# Altium schematic sheet 13 - USB.SchDoc
size B; CompanyName: Microchip Technology Inc.; Organization: Microchip Technology; Address1: 2355 West Chandler Blvd.; Address2: Chandler, AZ  85224; Address4: USA; DocumentNumber: 13; SheetNumber: 13; SheetTotal: 15; SheetTitle: USBB, USBC; Time: Time
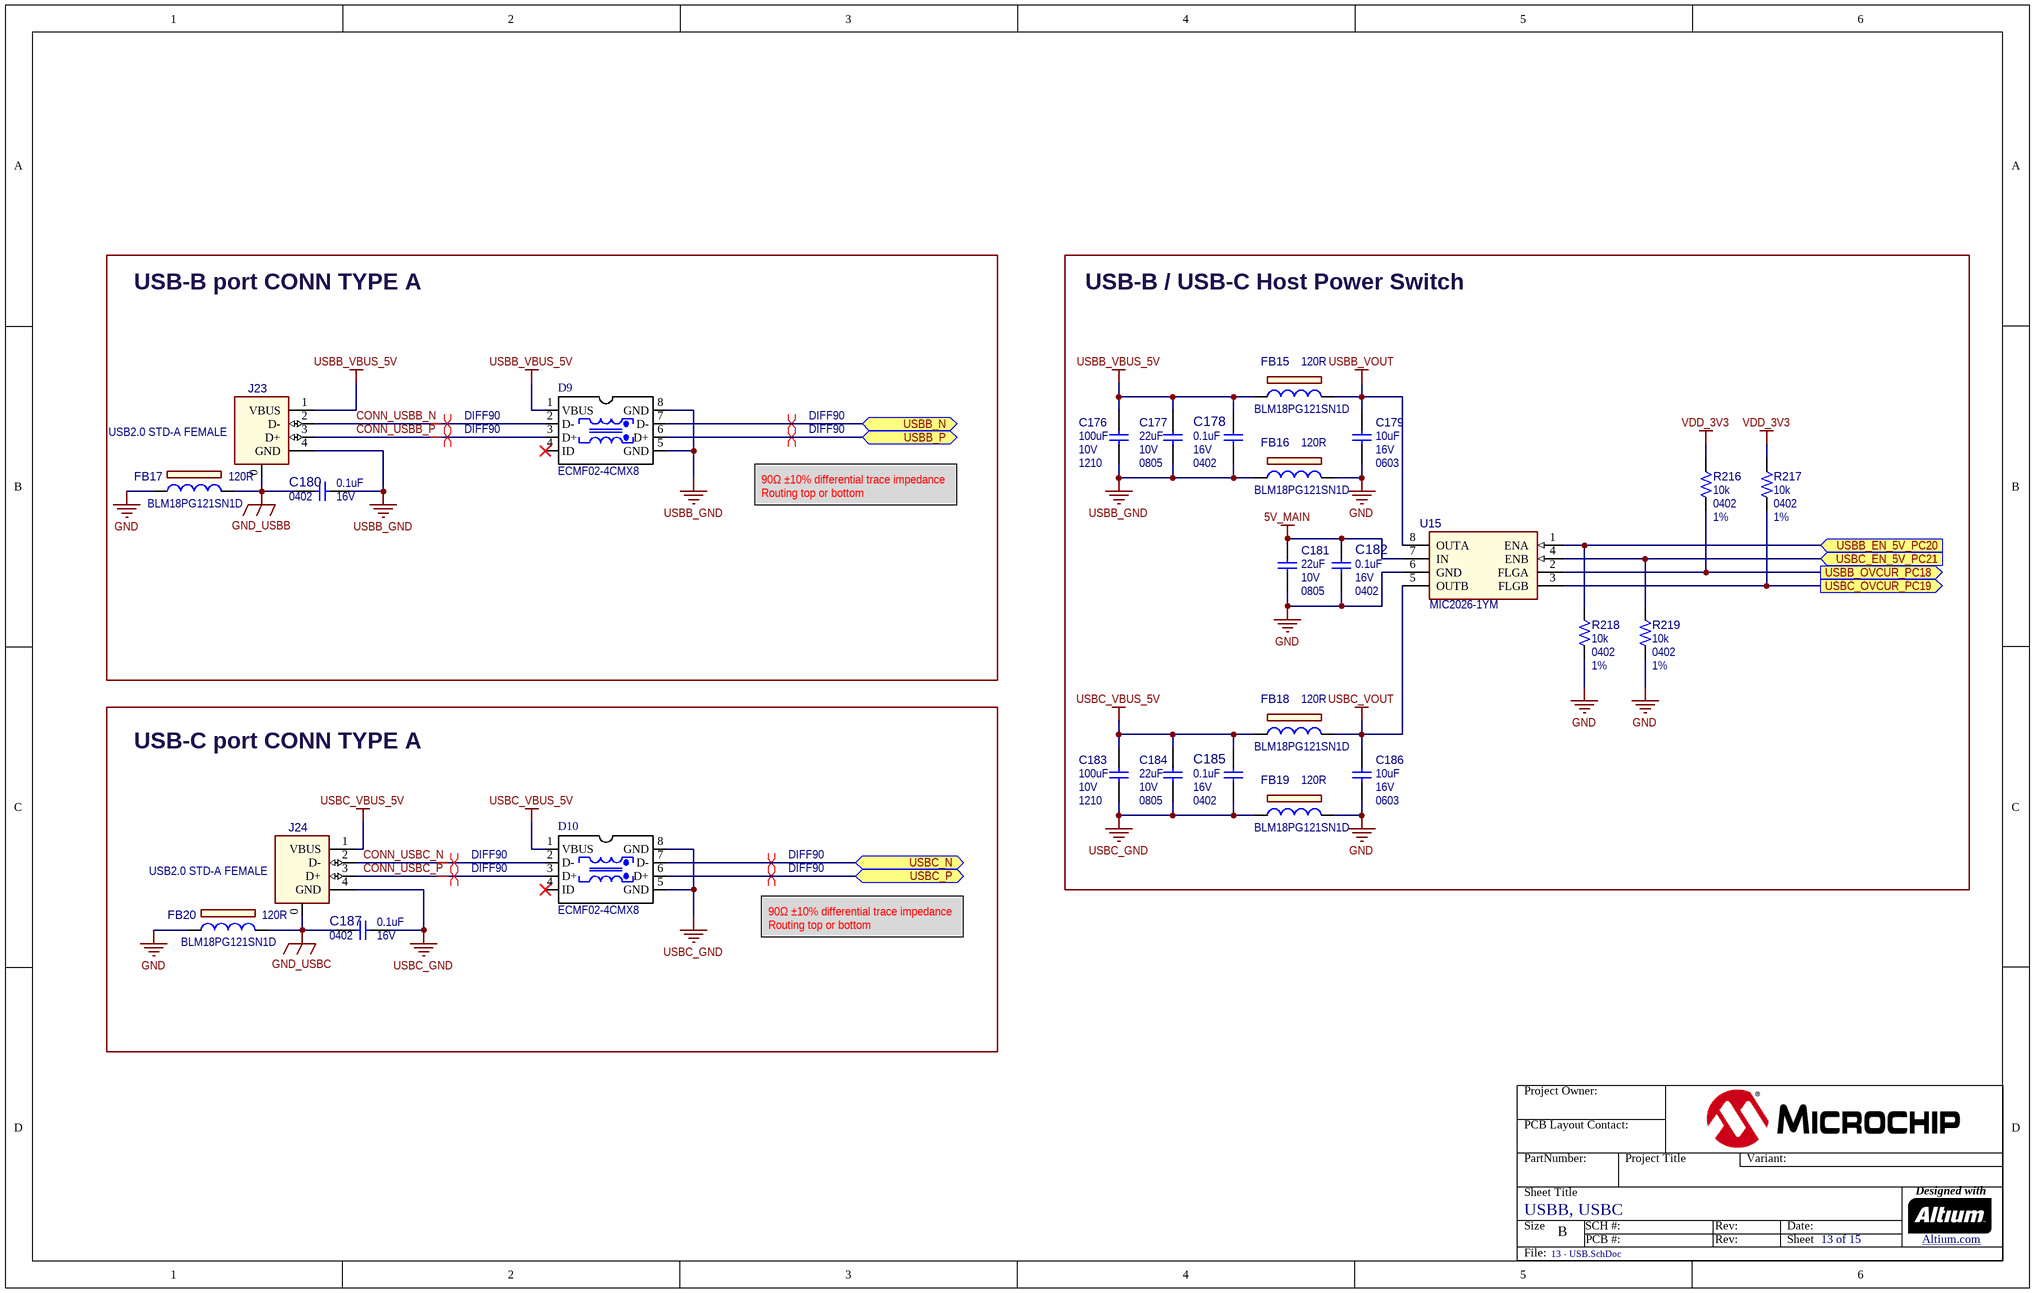
[diagram p0: 13 - USB.SchDoc]

## Parts
C176  value 100uF  Voltage: 10V  Package: 1210  [CAP_C_1210]  (hidden comment: Capacitor NP)
C177  value 22uF  Voltage: 10V  Package: 0805  [CAP_C_0805]  (hidden comment: Capacitor NP)
C178  value 0.1uF  Voltage: 16V  Package: 0402  [CAP_C_0402]  (hidden comment: Capacitor NP)
C179  value 10uF  Voltage: 16V  Package: 0603  [CAP_C_0603]  (hidden comment: Capacitor NP)
C180  value 0.1uF  Voltage: 16V  Package: 0402  [CAP_C_0402]  (hidden comment: Capacitor NP)
C181  value 22uF  Voltage: 10V  Package: 0805  [CAP_C_0805]  (hidden comment: Capacitor NP)
C182  value 0.1uF  Voltage: 16V  Package: 0402  [CAP_C_0402]  (hidden comment: Capacitor NP)
C183  value 100uF  Voltage: 10V  Package: 1210  [CAP_C_1210]  (hidden comment: Capacitor NP)
C184  value 22uF  Voltage: 10V  Package: 0805  [CAP_C_0805]  (hidden comment: Capacitor NP)
C185  value 0.1uF  Voltage: 16V  Package: 0402  [CAP_C_0402]  (hidden comment: Capacitor NP)
C186  value 10uF  Voltage: 16V  Package: 0603  [CAP_C_0603]  (hidden comment: Capacitor NP)
C187  value 0.1uF  Voltage: 16V  Package: 0402  [CAP_C_0402]  (hidden comment: Capacitor NP)
D9  value ECMF02-4CMX8  [DIODE ESD ECMF02-4CMX8]  (hidden comment: ESD_ECMF02-4CMX8)
D10  value ECMF02-4CMX8  [DIODE ESD ECMF02-4CMX8]  (hidden comment: ESD_ECMF02-4CMX8)
FB15  value 120R  Manufacturer Part Number 1: BLM18PG121SN1D  [IND_C_0603]  (hidden comment: Ferrite Bead)
FB16  value 120R  Manufacturer Part Number 1: BLM18PG121SN1D  [IND_C_0603]  (hidden comment: Ferrite Bead)
FB17  value 120R  Manufacturer Part Number 1: BLM18PG121SN1D  [IND_C_0603]  (hidden comment: Ferrite Bead)
FB18  value 120R  Manufacturer Part Number 1: BLM18PG121SN1D  [IND_C_0603]  (hidden comment: Ferrite Bead)
FB19  value 120R  Manufacturer Part Number 1: BLM18PG121SN1D  [IND_C_0603]  (hidden comment: Ferrite Bead)
FB20  value 120R  Manufacturer Part Number 1: BLM18PG121SN1D  [IND_C_0603]  (hidden comment: Ferrite Bead)
J23  value USB2.0 STD-A FEMALE  [CON_USB2.0-A_TH_RA_FCI_87520-0010BLF]  (hidden comment: CON USB2.0 A-B)
J24  value USB2.0 STD-A FEMALE  [CON_USB2.0-A_TH_RA_FCI_87520-0010BLF]  (hidden comment: CON USB2.0 A-B)
R216  value 10k  Package: 0402  Tolerance: 1%  [RES_C_0402]  (hidden comment: Resistor)
R217  value 10k  Package: 0402  Tolerance: 1%  [RES_C_0402]  (hidden comment: Resistor)
R218  value 10k  Package: 0402  Tolerance: 1%  [RES_C_0402]  (hidden comment: Resistor)
R219  value 10k  Package: 0402  Tolerance: 1%  [RES_C_0402]  (hidden comment: Resistor)
U15  value MIC2026-1YM  [SOIC-8]  (hidden comment: MIC2026-2076 DIP-8 SOIC-8)

## Blocks framed on the sheet
USB-B port CONN TYPE A: C180 D9 FB17 J23
USB-B / USB-C Host Power Switch: C176-C179 C181-C186 FB15 FB16 FB18 FB19 R216-R219 U15
USB-C port CONN TYPE A: C187 D10 FB20 J24

## Ports
USBB_EN_5V_PC20 (in), USBB_N (bidir), USBB_OVCUR_PC18 (out), USBB_P (bidir), USBC_EN_5V_PC21 (in), USBC_N (bidir), USBC_OVCUR_PC19 (out), USBC_P (bidir)

## Nets
5V_MAIN: C181.1 C182.1 U15.7(IN)
GND: C179.2 C181.2 C182.2 C186.2 FB16.2 FB17.1 FB19.2 FB20.1 R218.1 R219.1 U15.6(GND)
GND_USBB: C180.1 FB17.2 J23.0(SHLD)
GND_USBC: C187.1 FB20.2 J24.0(SHLD)
USBB_GND: C176.2 C177.2 C178.2 C180.2 D9.5(GND) D9.8(GND) FB16.1 J23.4(GND)
USBB_VBUS_5V: C176.1 C177.1 C178.1 D9.1(VBUS) FB15.1 J23.1(VBUS)
USBB_VOUT: C179.1 FB15.2 U15.8(OUTA)
USBC_GND: C183.2 C184.2 C185.2 C187.2 D10.5(GND) D10.8(GND) FB19.1 J24.4(GND)
USBC_VBUS_5V: C183.1 C184.1 C185.1 D10.1(VBUS) FB18.1 J24.1(VBUS)
USBC_VOUT: C186.1 FB18.2 U15.5(OUTB)
VDD_3V3: R216.2 R217.2
CONN_USBB_N: D9.2(D-) J23.2(D-)
CONN_USBB_P: D9.3(D+) J23.3(D+)
CONN_USBC_N: D10.2(D-) J24.2(D-)
CONN_USBC_P: D10.3(D+) J24.3(D+)
USBB_EN_5V_PC20: R218.2 U15.1(ENA) ; port USBB_EN_5V_PC20
USBB_N: D9.7(D-) ; port USBB_N
USBB_OVCUR_PC18: R216.1 U15.2(FLGA) ; port USBB_OVCUR_PC18
USBB_P: D9.6(D+) ; port USBB_P
USBC_EN_5V_PC21: R219.2 U15.4(ENB) ; port USBC_EN_5V_PC21
USBC_N: D10.7(D-) ; port USBC_N
USBC_OVCUR_PC19: R217.1 U15.3(FLGB) ; port USBC_OVCUR_PC19
USBC_P: D10.6(D+) ; port USBC_P

Not connected (* = marked no-connect by the designer): D9 4(ID)*; D10 4(ID)*

## Layout directives
differential pair; differential pair class DIFF90; net class DIFF90; rule Matched Net Lengths [Tolerance = 4mil]: CONN_USBB_N, CONN_USBB_P, CONN_USBC_N, CONN_USBC_P, USBB_N, USBB_P, USBC_N, USBC_P

## Notes on the sheet
- 90Ω ±10% differential trace impedance
  Routing top or bottom
- Project Owner:
- PCB Layout Contact:
- PartNumber:
- Project Title
- Variant:
- Sheet Title
- Size
- B
- SCH #:
- PCB #:
- Rev:
- Date:
- Sheet
- Designed with
- Altium.com <http://go.altium.com/MicrochipLandingPage_Evaluation.html>
- File:

## Library data of the parts
C176 C183 = CAP0598: Capacitor; Manufacturer 1: Murata Electronics North America; Manufacturer Part Number 1: GRM32ER61A107ME20L; Description_: CAP CER 100uF 10V 20% X5R SMD 1210; Dev Tools Status: Production; Tolerance: 20%; Temperature Coeffcient: X5R; Type: Ceramic; Populated: Yes; MCHP-ID: CAP0598; Revision: 1; Symbol: Capacitor NP; Status: MCL Design; ComponentLink1URL: https://chn-vm-apps.microchip.com/mchprepo/parts/Datasheets/mlcc01_e.pdf; ComponentLink1Description: SVN Datasheet; ComponentLink2URL: C:\ALTIUM_WORK\00001_MCHP-CDB\Datasheets\mlcc01_e.pdf; ComponentLink2Description: Local Datasheet; ComponentLink3URL: C:\ALTIUM_WORK\00001_MCHP-CDB\Library\LibraryRefs\Capacitor NP.SchLib; ComponentLink3Description: Open Symbol; ComponentLink4URL: C:\ALTIUM_WORK\00001_MCHP-CDB\Library\Footprints\CAP_C_1210.PcbLib; ComponentLink4Description: Open Footprint; ComponentLink5Description: Open Footprint 2; ComponentLink6Description: Open Footprint 3; ComponentLink7Description: Open Footprint 4; Operating Temperature: -55C to +85C; Category: Capacitor; Manufacturer 2: Taiyo Yuden; Manufacturer Part Number 2: LMK325BJ107MM-T; Supplier 1: Digi-Key; Supplier Part Number 1: 490-9969-1-ND; Supplier 2: Digi-Key; Supplier Part Number 2: 587-1965-1-ND; Quantity Override: 1
C177 C181 C184 = CAP1618: Manufacturer 1: TDK Corporation; Manufacturer Part Number 1: C2012X7S1A226M125AC; Description_: CAP CER 22uF 10V 20% X7S SMD 0805; Dev Tools Status: Production; Tolerance: 20%; Temperature Coefficient: X7S; Type: Ceramic; Populated: YES; Owner: Razvan Cristescu; Restricted Sourcing: No; MCHP-ID: CAP1618; Revision: 3; Symbol: Capacitor NP; Status: MCL Design; ComponentLink1URL: https://chn-vm-apps.microchip.com/mchprepo/parts/Datasheets/mlcc_commercial_general_en.pdf; ComponentLink1Description: SVN Datasheet; ComponentLink2URL: C:\ALTIUM_WORK\00001_MCHP-CDB\Datasheets\mlcc_commercial_general_en.pdf; ComponentLink2Description: Local Datasheet; ComponentLink3URL: C:\ALTIUM_WORK\00001_MCHP-CDB\Library\LibraryRefs\Capacitor NP.SchLib; ComponentLink3Description: Open Symbol; ComponentLink4URL: C:\ALTIUM_WORK\00001_MCHP-CDB\Library\Footprints\CAP_C_0805.PcbLib; ComponentLink4Description: Open Footprint; ComponentLink5Description: Open Footprint 2; ComponentLink6Description: Open Footprint 3; ComponentLink7Description: Open Footprint 4; Operating Temperature: -55C to +125C; Category: Capacitor; Supplier 1: Digi-Key; Supplier Part Number 1: 445-14560-1-ND; Quantity Override: 1
C178 C182 C185 = CAP1033: Manufacturer 1: Hottech; Manufacturer Part Number 1: C1005B104K160NT; Description_: CAP CER 0.1uF 16V 10% X7R SMD 0402; Dev Tools Status: Production; Tolerance: 10%; Type: Ceramic; Owner: Sompoch Loboonlert; Populated: Yes; Temperature Coefficient: X7R; Restricted Sourcing: No; MCHP-ID: CAP1033; Revision: 10; Symbol: Capacitor NP; Status: MCL Design; ComponentLink1URL: https://chn-vm-apps.microchip.com/mchprepo/parts/Datasheets/L0005E.pdf; ComponentLink1Description: SVN Datasheet; ComponentLink2URL: C:\ALTIUM_WORK\00001_MCHP-CDB\Datasheets\L0005E.pdf; ComponentLink2Description: Local Datasheet; ComponentLink3URL: C:\ALTIUM_WORK\00001_MCHP-CDB\Library\LibraryRefs\Capacitor NP.SchLib; ComponentLink3Description: Open Symbol; ComponentLink4URL: C:\ALTIUM_WORK\00001_MCHP-CDB\Library\Footprints\CAP_C_0402.PcbLib; ComponentLink4Description: Open Footprint; ComponentLink5Description: Open Footprint 2; ComponentLink6Description: Open Footprint 3; ComponentLink7Description: Open Footprint 4; Operating Temperature: -55C to +125C; Category: Capacitor; Supplier 1: Hottech; Supplier Part Number 1: C1005B104K160NT; Quantity Override: 1; Manufacturer 2: KEMET; Manufacturer Part Number 2: C0402C104K4RAC7867; Manufacturer 3: Samsung Electro-Mechanics; Manufacturer Part Number 3: CL05B104KO5NNNC; Supplier 2: Digi-Key; Supplier Part Number 2: 399-C0402C104K4RAC7867TR-ND; Supplier 3: Digi-Key; Supplier Part Number 3: 1276-1001-1-ND; Manufacturer 4: Würth Elektronik; Manufacturer Part Number 4: 885012205037; Manufacturer 5: Samsung Electro-Mechanics; Manufacturer Part Number 5: CL05B104KO5NNND; Manufacturer 6: Samsung Electro-Mechanics; Manufacturer Part Number 6: CL05B104KO5NNNO; Manufacturer 7: Yageo; Manufacturer Part Number 7: CC0402KRX7R7BB104; Supplier 4: Digi-Key; Supplier Part Number 4: 732-7532-1-ND; Supplier 5: Mouser; Supplier Part Number 5: 187-CL05B104KO5NNND; Supplier 6: Samsung Electro-Mechanics; Supplier Part Number 6: CL05B104KO5NNNO; Supplier 7: Yageo; Supplier Part Number 7: CC0402KRX7R7BB104
C179 C186 = CAP2397: Manufacturer 1: Murata; Manufacturer Part Number 1: GRT188R61C106KE13D; Description_: CAP CER 10uF 16V 10% X5R SMD 0603 AEC-Q200; Dev Tools Status: Design; Tolerance: 10%; Temperature Coefficient: X5R; Type: Ceramic; Populated: YES; Owner: Sam Charles; MCHP-ID: CAP2397; Revision: 1; Symbol: Capacitor NP; Status: MCL Design; ComponentLink1URL: https://chn-vm-apps.microchip.com/mchprepo/parts/Datasheets/GRT188R61C106KE13-01.pdf; ComponentLink1Description: SVN Datasheet; ComponentLink2URL: C:\ALTIUM_WORK\00001_MCHP-CDB\Datasheets\GRT188R61C106KE13-01.pdf; ComponentLink2Description: Local Datasheet; ComponentLink3URL: C:\ALTIUM_WORK\00001_MCHP-CDB\Library\LibraryRefs\Capacitor NP.SchLib; ComponentLink3Description: Open Symbol; ComponentLink4URL: C:\ALTIUM_WORK\00001_MCHP-CDB\Library\Footprints\CAP_C_0603.PcbLib; ComponentLink4Description: Open Footprint; ComponentLink5Description: Open Footprint 2; ComponentLink6Description: Open Footprint 3; ComponentLink7Description: Open Footprint 4; Operating Temperature: -55°C ~ 85°C; Category: Capacitor; Supplier 1: Digi-Key; Supplier Part Number 1: 490-12317-1-ND; Quantity Override: 1
C180 C187 = CAP1033: Manufacturer 1: Hottech; Manufacturer Part Number 1: C1005B104K160NT; Description_: CAP CER 0.1uF 16V 10% X7R SMD 0402; Dev Tools Status: Production; Tolerance: 10%; Temperature Coefficient: X7R; Type: Ceramic; Owner: Sompoch Loboonlert; Populated: Yes; Restricted Sourcing: No; MCHP-ID: CAP1033; Revision: 10; Symbol: Capacitor NP; Status: MCL Design; ComponentLink1URL: https://chn-vm-apps.microchip.com/mchprepo/parts/Datasheets/L0005E.pdf; ComponentLink1Description: SVN Datasheet; ComponentLink2URL: C:\ALTIUM_WORK\00001_MCHP-CDB\Datasheets\L0005E.pdf; ComponentLink2Description: Local Datasheet; ComponentLink3URL: C:\ALTIUM_WORK\00001_MCHP-CDB\Library\LibraryRefs\Capacitor NP.SchLib; ComponentLink3Description: Open Symbol; ComponentLink4URL: C:\ALTIUM_WORK\00001_MCHP-CDB\Library\Footprints\CAP_C_0402.PcbLib; ComponentLink4Description: Open Footprint; ComponentLink5Description: Open Footprint 2; ComponentLink6Description: Open Footprint 3; ComponentLink7Description: Open Footprint 4; Operating Temperature: -55C to +125C; Category: Capacitor; Supplier 1: Hottech; Supplier Part Number 1: C1005B104K160NT; Quantity Override: 1; Manufacturer 2: KEMET; Manufacturer Part Number 2: C0402C104K4RAC7867; Manufacturer 3: Samsung Electro-Mechanics; Manufacturer Part Number 3: CL05B104KO5NNNC; Manufacturer 4: Würth Elektronik; Manufacturer Part Number 4: 885012205037; Manufacturer 5: Samsung Electro-Mechanics; Manufacturer Part Number 5: CL05B104KO5NNND; Manufacturer 6: Samsung Electro-Mechanics; Manufacturer Part Number 6: CL05B104KO5NNNO; Manufacturer 7: Yageo; Manufacturer Part Number 7: CC0402KRX7R7BB104; Supplier 2: Digi-Key; Supplier Part Number 2: 399-C0402C104K4RAC7867TR-ND; Supplier 3: Digi-Key; Supplier Part Number 3: 1276-1001-1-ND; Supplier 4: Digi-Key; Supplier Part Number 4: 732-7532-1-ND; Supplier 5: Mouser; Supplier Part Number 5: 187-CL05B104KO5NNND; Supplier 6: Samsung Electro-Mechanics; Supplier Part Number 6: CL05B104KO5NNNO; Supplier 7: Yageo; Supplier Part Number 7: CC0402KRX7R7BB104
D9 D10 = IC1580: IC ESD FILTER COMM MODE 8-UQFN; Manufacturer 1: STMicroelectronics; MCHP-ID: IC1580; Description_: IC FILTER ECMF02-4CMX8 COMMON MODE ESD QFN-8L; Dev Tools Status: Production; Owner: Dragos Danaila; Populated: YES; Restricted Sourcing: No; Vin: 16V; Revision: 1; Symbol: DIODE ESD ECMF02-4CMX8; Status: MCL Design; Package: QFN-8L; ComponentLink1URL: https://chn-vm-apps.microchip.com/mchprepo/parts/Datasheets/en.DM00039389.pdf; ComponentLink1Description: SVN Datasheet; ComponentLink2URL: C:\ALTIUM_WORK\00001_MCHP-CDB\Datasheets\en.DM00039389.pdf; ComponentLink2Description: Local Datasheet; ComponentLink3URL: C:\ALTIUM_WORK\00001_MCHP-CDB\Library\LibraryRefs\DIODE ESD ECMF02-4CMX8.SchLib; ComponentLink3Description: Open Symbol; ComponentLink4URL: C:\ALTIUM_WORK\00001_MCHP-CDB\Library\Footprints\DIODE ESD ECMF02-4CMX8.PcbLib; ComponentLink4Description: Open Footprint; ComponentLink5Description: Open Footprint 2; ComponentLink6Description: Open Footprint 3; ComponentLink7Description: Open Footprint 4; Operating Temperature: -40C to +125C; Type: Filter; Category: IC; Manufacturer Part Number 1: ECMF02-4CMX8; Supplier 1: Digi-Key; Supplier Part Number 1: 497-13420-1-ND; Quantity Override: 1
FB15-FB20 = IND1009: Manufacturer 1: Murata; Description_: FERRITE BEAD 120 OHM 0603 1LN; Dev Tools Status: Production; Owner: Petnarong Chaijaroong; DCR: 0.05R; Saturation Current: 12A; Populated: Yes; Restricted Sourcing: No; MCHP-ID: IND1009; Revision: 0; Symbol: Ferrite Bead; Status: MCL Design; ComponentLink1URL: https://chn-vm-apps.microchip.com/mchprepo/parts/Datasheets/L0110S0100BLM18P.pdf; ComponentLink1Description: SVN Datasheet; ComponentLink2URL: C:\ALTIUM_WORK\00001_MCHP-CDB\Datasheets\L0110S0100BLM18P.pdf; ComponentLink2Description: Local Datasheet; ComponentLink3URL: C:\ALTIUM_WORK\00001_MCHP-CDB\Library\LibraryRefs\Ferrite Bead.SchLib; ComponentLink3Description: Open Symbol; ComponentLink4URL: C:\ALTIUM_WORK\00001_MCHP-CDB\Library\Footprints\IND_C_0603.PcbLib; ComponentLink4Description: Open Footprint; ComponentLink5Description: Open Footprint 2; ComponentLink6Description: Open Footprint 3; ComponentLink7Description: Open Footprint 4; Operating Temperature: -55C to +125C; Package: 0603; Type: Ferrite Bead; Category: Inductor; Supplier 1: digikey; Supplier Part Number 1: 490-1037-1-ND; Quantity Override: 1
J23 J24 = CON0280: Connector USB; Manufacturer 1: TE Connectivity AMP Connectors; Manufacturer Part Number 1: 292303-1; Description_: CON USB2.0 STD-A FEMALE TH R/A; Dev Tools Status: Production; Owner: Bogdan Popescu; Populated: YES; MCHP-ID: CON0280; Revision: 2; Symbol: CON USB2.0 A-B; Status: MCL Design; ComponentLink1URL: https://chn-vm-apps.microchip.com/mchprepo/parts/Datasheets/87520.pdf; ComponentLink1Description: SVN Datasheet; ComponentLink2URL: C:\ALTIUM_WORK\00001_MCHP-CDB\Datasheets\87520.pdf; ComponentLink2Description: Local Datasheet; ComponentLink3URL: C:\ALTIUM_WORK\00001_MCHP-CDB\Library\LibraryRefs\CON USB2.0 A-B.SchLib; ComponentLink3Description: Open Symbol; ComponentLink4URL: C:\ALTIUM_WORK\00001_MCHP-CDB\Library\Footprints\CON_USB2.0-A_TH_RA_FCI_87520-0010BLF.PcbLib; ComponentLink4Description: Open Footprint; ComponentLink5Description: Open Footprint 2; ComponentLink6Description: Open Footprint 3; ComponentLink7Description: Open Footprint 4; Type: USB; Category: Connector; Manufacturer 2: Dongguan Yang Ming Precision Plastic Hardware Electronics Co., Ltd. (ShenZhen YangMing); Manufacturer Part Number 2: YM-02-04-B-18; Supplier 1: Digi-Key; Supplier Part Number 1: A31726-ND; Supplier 2: Raynen; Supplier Part Number 2: PLUG00057C01M; Quantity Override: 1
R216-R219 = RSMT1019: Manufacturer 1: Panasonic; Manufacturer Part Number 1: ERJ-2RKF1002X; Description_: RES TKF 10k 1% 1/10W SMD 0402; Dev Tools Status: Production; Voltage: 50V; Temperature Coeffcient: 100ppm/C; Power: 1/10W; Owner: Brent Lanphear; Populated: YES; MCHP-ID: RSMT1019; Revision: 2; Symbol: Resistor; Status: MCL Design; ComponentLink1URL: https://chn-vm-apps.microchip.com/mchprepo/parts/Datasheets/AOA0000CE2.pdf; ComponentLink1Description: SVN Datasheet; ComponentLink2URL: C:\ALTIUM_WORK\00001_MCHP-CDB\Datasheets\AOA0000CE2.pdf; ComponentLink2Description: Local Datasheet; ComponentLink3URL: C:\ALTIUM_WORK\00001_MCHP-CDB\Library\LibraryRefs\Resistor.SchLib; ComponentLink3Description: Open Symbol; ComponentLink4URL: C:\ALTIUM_WORK\00001_MCHP-CDB\Library\Footprints\RES_C_0402.PcbLib; ComponentLink4Description: Open Footprint; ComponentLink5Description: Open Footprint 2; ComponentLink6Description: Open Footprint 3; ComponentLink7Description: Open Footprint 4; Operating Temperature: -55C to +155C; Category: Resistor; Type: RES SMD; Composition: TKF; Supplier 1: Digi-Key; Supplier Part Number 1: P10.0KLCT-ND; Quantity Override: 1
U15 = MIC8160: Manufacturer 1: Microchip Technology; Manufacturer Part Number 1: MIC2026-1YM-TR; Description_: MCHP ANALOG POWER SWITCH 5.5V MIC2026-1YM SOIC-8; Dev Tools Status: Production; Owner: Sam Charles; Populated: YES; MCHP-ID: MIC8160; Symbol: MIC2026-2076 DIP-8 SOIC-8; Type: Power Switch; Status: MCL Design; Revision: 1; Category: MCHP-Analog; ComponentLink1Description: SVN Datasheet; ComponentLink2URL: C:\ALTIUM_WORK\00001_MCHP-CDB\Datasheets\mic2026.pdf; ComponentLink2Description: Local Datasheet; ComponentLink3URL: C:\ALTIUM_WORK\00001_MCHP-CDB\Library\LibraryRefs\MIC2026-2076 DIP-8 SOIC-8.SchLib; ComponentLink3Description: Open Symbol; ComponentLink4URL: C:\ALTIUM_WORK\00001_MCHP-CDB\Library\Footprints\SOIC-8.PcbLib; ComponentLink4Description: Open Footprint; ComponentLink5Description: Open Footprint 2; ComponentLink6Description: Open Footprint 3; ComponentLink7Description: Open Footprint 4; Manufacturer 2: Microchip; Manufacturer Part Number 2: MIC2026-1YM; Supplier 1: Digi-Key; Supplier Part Number 1: 576-1059-1-ND; Supplier 2: Digi-Key; Supplier Part Number 2: 576-1059-2-ND; Quantity Override: 1